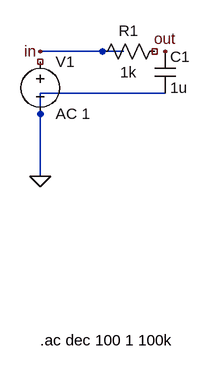
[diagram p0: schematic test01_rc_lowpass.asc]
test01_rc_lowpass.asc, the LTspice schematic file:
Version 4
SHEET 1 880 736
WIRE 0 288 0 384
WIRE 128 192 0 192
WIRE 192 256 0 256
WIRE 0 256 0 384
FLAG 0 384 0
FLAG 0 192 in
FLAG 192 192 out
SYMBOL voltage 0 192 R0
SYMATTR InstName V1
SYMATTR Value AC 1
SYMBOL res 192 176 R90
WINDOW 0 0 56 VBottom 2
WINDOW 3 32 56 VTop 2
SYMATTR InstName R1
SYMATTR Value 1k
SYMBOL cap 176 192 R0
SYMATTR InstName C1
SYMATTR Value 1u
TEXT 0 636 Left 2 !.ac dec 100 1 100k

The netlist it stands for:
* test01_rc_lowpass.asc
V1 NC_01 0 AC 1
R1 NC_02 in 1k
C1 out 0 1u
.ac dec 100 1 100k
.backanno
.end